# Altium schematic sheet PSU-schem.SchDoc: 13.8V 30A PSU
size Legal; Author: 4S6TMP; DrawnBy: 4S6TMP; Organization: 4S6TMP; Address1: Sri Lanka
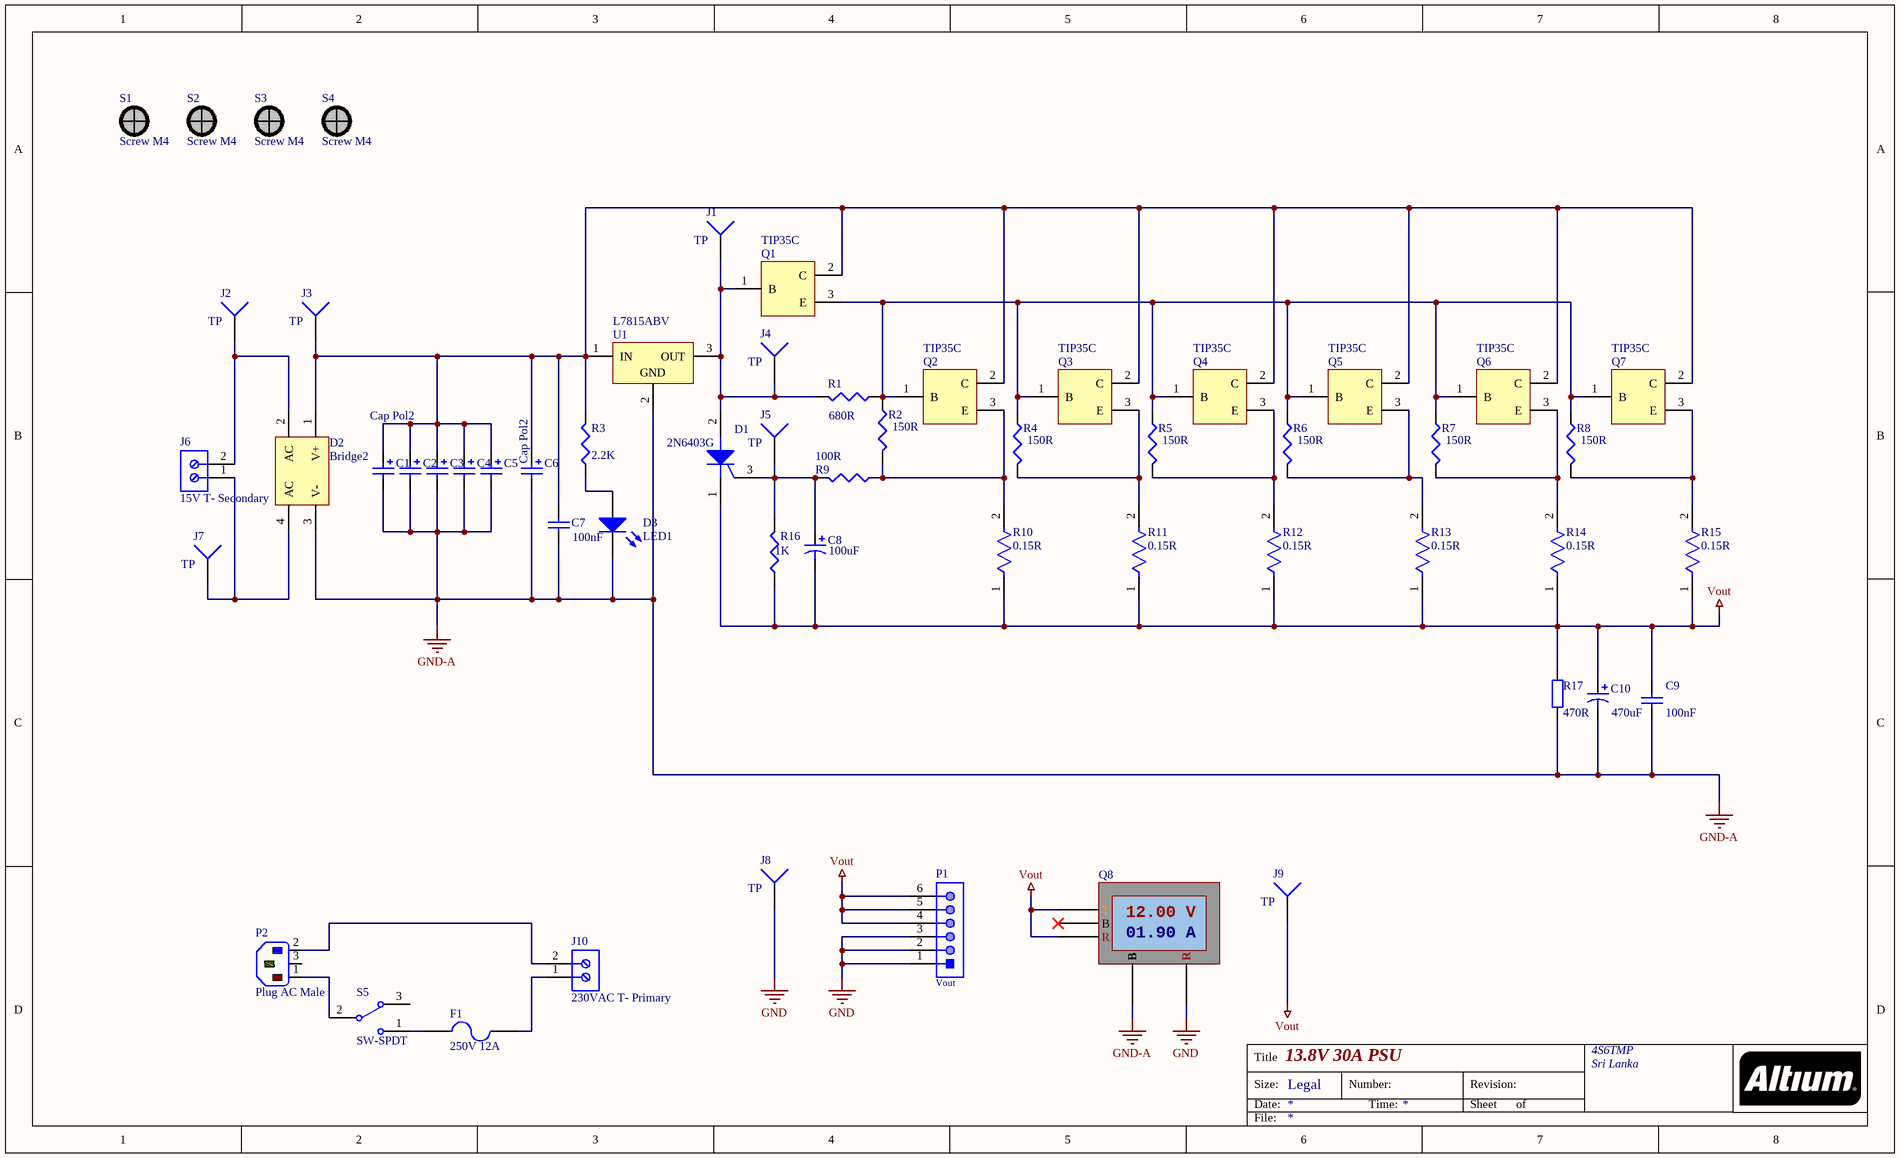
[diagram p0: PSU-schem.SchDoc]

## Parts
C1  Cap Pol2  [CAP 20mm diameter, 7.6mm pitch]
C2  Cap Pol2  [CAP 20mm diameter, 7.6mm pitch]  (value not drawn)
C3  Cap Pol2  [CAP 20mm diameter, 7.6mm pitch]  (value not drawn)
C4  Cap Pol2  [CAP 20mm diameter, 7.6mm pitch]  (value not drawn)
C5  Cap Pol2  [CAP 20mm diameter, 7.6mm pitch]  (value not drawn)
C6  Cap Pol2  [CAP 20mm diameter, 7.6mm pitch]
C7  value 100nF  [C 0603 / 1608]  (hidden comment: Cap)
C8  value 100uF  [CAPR5-4X5]  (hidden comment: Cap Pol3)
C9  value 100nF  [C 0603 / 1608]  (hidden comment: Cap)
C10  value 470uF  [RAD-0.3]  (hidden comment: Cap Pol3)
D1  2N6403G  [ONSC-TO-220-3-221A-07]
D2  Bridge2  [D-46_6A]
D3  LED1  [LED-1]
F1  250V 12A  [PIN-W2/E2.8]
J1  TP  [PIN1]
J2  TP  [PIN1]
J3  TP  [PIN1]
J4  TP  [PIN1]
J5  TP  [PIN1]
J6  15V T- Secondary  [TECO-282836-2_V]
J7  TP  [PIN1]
J8  TP  [PIN1]
J9  TP  [PIN1]
J10  230VAC T- Primary  [TECO-282836-2_V]
P1  Vout  [691312710006]
P2  Plug AC Male  [Screw terminal 3-pin 7.62mm]
Q1  TIP35C  [ONSC-SOT-93_TO-218-3-340D-02]
Q2  TIP35C  [ONSC-SOT-93_TO-218-3-340D-02]
Q3  TIP35C  [ONSC-SOT-93_TO-218-3-340D-02]
Q4  TIP35C  [ONSC-SOT-93_TO-218-3-340D-02]
Q5  TIP35C  [ONSC-SOT-93_TO-218-3-340D-02]
Q6  TIP35C  [ONSC-SOT-93_TO-218-3-340D-02]
Q7  TIP35C  [ONSC-SOT-93_TO-218-3-340D-02]
Q8  VA_Meter  [VA_Meter]  (value not drawn)
R1  value 680R  [3-0603]  (hidden comment: Res3)
R2  value 150R  [3-0603]  (hidden comment: Res3)
R3  value 2.2K  [3-0603]  (hidden comment: Res3)
R4  value 150R  [3-0603]  (hidden comment: Res3)
R5  value 150R  [3-0603]  (hidden comment: Res3)
R6  value 150R  [3-0603]  (hidden comment: Res3)
R7  value 150R  [3-0603]  (hidden comment: Res3)
R8  value 150R  [3-0603]  (hidden comment: Res3)
R9  value 100R  [3-0603]  (hidden comment: Res3)
R10  0.15R  [FP-AC05000003909JAC00-0]
R11  0.15R  [FP-AC05000003909JAC00-0]
R12  0.15R  [FP-AC05000003909JAC00-0]
R13  0.15R  [FP-AC05000003909JAC00-0]
R14  0.15R  [FP-AC05000003909JAC00-0]
R15  0.15R  [FP-AC05000003909JAC00-0]
R16  value 1K  [3-0603]  (hidden comment: Res3)
R17  value 470R  [AXIAL-0.4]  (hidden comment: Res2)
S1  Screw M4  [Screw M4]
S2  Screw M4  [Screw M4]
S3  Screw M4  [Screw M4]
S4  Screw M4  [Screw M4]
S5  SW-SPDT  [TL36WW15050]
U1  L7815ABV  [TO220]

## Nets
GND: J8.1 P1.1 P1.2 P1.3 Q8.5(R)
GND-A: C1.2 C2.2 C3.2 C4.2 C5.2 C6.2 C7.1 C9.1 C10.2 D2.3(V-) D3.2(K) Q8.4(B) R17.1 U1.2(GND)
Vout: C8.2 C9.2 C10.1 D1.1(K) J9.1 P1.4 P1.5 P1.6 Q8.1(Y) Q8.3(R) R10.1 R11.1 R12.1 R13.1 R14.1 R15.1 R16.1 R17.2
NetC1_1: C1.1 C2.1 C3.1 C4.1 C5.1 C6.1 C7.2 D2.1(V+) J3.1 Q1.2(C) Q2.2(C) Q3.2(C) Q4.2(C) Q5.2(C) Q6.2(C) Q7.2(C) R3.2 U1.1(IN)
NetC8_1: C8.1 D1.3(G) J5.1 R9.2 R16.2
NetD1_2: D1.2(A) J1.1 J4.1 Q1.1(B) R1.2 U1.3(OUT)
NetD2_2: D2.2(AC) J2.1 J6.2
NetD2_4: D2.4(AC) J6.1 J7.1
NetD3_1: D3.1(A) R3.1
NetF1_1: F1.1 S5.1
NetF1_2: F1.2 J10.1
NetJ10_2: J10.2 P2.2(N)
NetP2_1: P2.1(L) S5.2
NetQ1_3: Q1.3(E) Q2.1(B) Q3.1(B) Q4.1(B) Q5.1(B) Q6.1(B) Q7.1(B) R1.1 R2.1 R4.1 R5.1 R6.1 R7.1 R8.1
NetQ2_3: Q2.3(E) R2.2 R9.1 R10.2
NetQ3_3: Q3.3(E) R4.2 R11.2
NetQ4_3: Q4.3(E) R5.2 R12.2
NetQ5_3: Q5.3(E) R6.2 R13.2
NetQ6_3: Q6.3(E) R7.2 R14.2
NetQ7_3: Q7.3(E) R8.2 R15.2

Not connected (* = marked no-connect by the designer): P2 3(E); Q8 2(B)*; S5 3

## Notes on the sheet
- Title
- Size:
- Date:
- Legal
- Number:
- Time:
- Revision:
- Sheet
- of
- File:
- (in symbol VA_Meter) 12.00 V; 01.90 A

## Library data of the parts
C1-C6 = Cap Pol2: Polarized Capacitor (Axial); Value: 100pF; Published: 8-Jun-2000; LatestRevisionDate: 17-Jul-2002; LatestRevisionNote: Re-released for DXP Platform.; PackageReference: POLAR0.8; Publisher: Altium Limited; PackageDescription: Polarized Capacitor; 2 Leads
C7 C9 = Cap: Capacitor; Published: 8-Jun-2000; LatestRevisionDate: 17-Jul-2002; LatestRevisionNote: Re-released for DXP Platform.; PackageReference: RAD-0.3; Publisher: Altium Limited; PackageDescription: Radial Cap, Thru-Hole; 2 Leads; 0.3 in Pin Spacing
C8 C10 = Cap Pol3: Polarized Capacitor (Surface Mount); Published: 8-Jun-2000; LatestRevisionDate: 29-May-2009; LatestRevisionNote: IPC-7351 Footprint Added.; PackageReference: C0805; Publisher: Altium Limited; PackageDescription: Chip Capacitor
D1 = CMP-1068-00092-1: Silicon Controlled Rectifier, Reverse Blocking Thyristor, 3-Pin TO-220, Pb-Free, Bulk Box; Manufacturer: On Semiconductor; IT(RMS) Max (A): 16; ITSM Max (A): 160; RoHS: Pb-Free; PartNumber: 2N6403G; ComponentLink1URL: http://www.onsemi.com/; PackageDescription: 3-Pin Flange Mount, Vertical Straight Lead, Body 9.97 x 4.445 mm, Pitch 2.54 mm; ComponentLink3Description: Package Specification; ComponentLink3URL: http://www.onsemi.com/pub_link/Collateral/221A-07.PDF; PackageReference: TO-220-3-221A-07; Packing: Bulk Box; DatasheetVersion: Rev. 6; ComponentLink1Description: Manufacturer URL; Mounting Technology: Through Hole; ComponentLink2URL: http://www.onsemi.cn/pub_link/Collateral/2N6400-D.PDF; ComponentLink2Description: Datasheet; PackageVersion: Rev. O, 07/2008
D2 = Bridge2: Diode Bridge; Published: 24-Mar-1999; LatestRevisionDate: 17-Jul-2002; LatestRevisionNote: Re-released for DXP Platform.; PackageReference: D-46_6A; Publisher: Altium Limited; PackageDescription: Bridge Rectifier; 4 Terminals; Body 16.8 x 16.8 mm (typ); Pitch 10.67 mm
D3 = LED1: Typical RED GaAs LED; Published: 8-Jun-2000; LatestRevisionDate: 08-Jul-2005; LatestRevisionNote: Mech Layer 1 removed.; PackageReference: LED-1; Publisher: Altium Limited; PackageDescription: LED; 2 Leads
F1 = Fuse 2: Fuse; Published: 8-Jun-2000; LatestRevisionDate: 17-Jul-2002; LatestRevisionNote: Re-released for DXP Platform.; PackageReference: PIN-W2/E2.8; Publisher: Altium Limited; PackageDescription: Thru-Hole; 2 Leads
J1-J5 J7-J9 = Socket: LatestRevisionDate: 17-Jul-2002; LatestRevisionNote: Re-released for DXP Platform.; Publisher: Altium Limited
J6 J10 = CMP-1684-00017-1: Female Header, Pitch 5 mm, 1 x 2 Position, Height 10 mm, Tail Length 3.5 mm, Rohs, Bulk; Manufacturer: TE Connectivity; Wire Gauge: 16-30AWG; Product Training Modules: Wire-to-BoardEurostyleTerminalBlocks; Clamp Material - Plating: Brass-NickelPlated; Voltage: 300V; Mating Orientation: HorizontalwithBoard; Current: 13.5A; Pitch: 0.197"(5.00mm); Screw Thread: M3; 3D Model: 282836-2.pdf; Other Names: 5ULV-02B / A98076; Dynamic Catalog: BuchananSeries; Number of Levels: 1; Torque - Screw: 0.68Nm(6Lb-In); Featured Product: EurostyleTerminalBlockConnectors; Positions Per Level: 2; Wire Termination: Screw-RisingCageClamp; Datasheet URL: http://www.te.com.cn/commerce/DocumentDelivery/DDEController?Action=showdoc&DocId=Catalog+Section%7F1308389_EUROSTYLE_TERMINAL_BLOCKS%7F0607%7Fpdf%7FEnglish%7FENG_CS_1308389_EUROSTYLE_TERMINAL_BLOCKS_0607.pdf%7F282836-2; Color: Green; Family: TerminalBlocks-WiretoBoard; RoHS Information: 282836-2StatementofCompliance; Standard Package: 300; Contact Material - Plating: Brass-TinPlated; Manufacturer URL: http://www.te.com; Housing Material: Polyamide(PA66),Nylon6/6; Features: Interlocking(Side); Package Description: Female Header, Pitch 5 mm, 1 x 2 Position, Height 10 mm, Tail Length 3.5 mm; Mounting Type: ThroughHole; Package Reference: THD; Packaging: Bulk; Series: Buchanan; Category: Connectors,Interconnects; Screw Material - Plating: Brass-NickelPlated
P1 = CMP-1502-02044-1: Serie 3127 - 5.00mm Open Horizontal PCB Header WR-TBL, 6 pin; Manufacturer: Wurth Elektronik; Pin Number: 6; Gender: Male; Part Number: 691312710006; Datasheet URL: http://katalog.we-online.de/em/datasheet/6913127100xx.pdf; Manufacturer URL: http://www.we-online.de; Operating Temperature: -40to105degC; Publisher: WurthElektronik; Package Reference: 691312710006; Mounting Technology: THT; Packaging: Box; Pitch: 5.00mm
P2 = Plug AC Male: IEC Mains Power Inlet, EN60 320-1 C14 Class I Cold Condition, PC Flange Rear Mount, Chassis Plug; PackageDocument: ver.80, 15-Sep-2003; MaximumRating: 10A, 250V a.c. (UL & CSA 15A, 250V a.c.); MountingFixtures: Not drawn on schematic symbol.; PCB_Layout: Complies with manufacturer's recommendation.; DrillSize: Corresponds to nominal value.; Note: IEC Color Scheme employed for L, N and E.; Published: 15-Jul-2004; LatestRevisionDate: 15-Jul-2004; LatestRevisionNote: Component Replaced.; DatasheetDocument: ver.80, 15-Sep-2003; PackageReference: PX0580/PC; Publisher: Altium Limited; Terminations: P.C. Spills; ComponentLink1Description: Manufacturer Link; ComponentLink1URL: http://www.bulgin.co.uk/
Q1-Q7 = CMP-1048-00995-1: Complementary Silicon High-Power Transistor, 3-Pin SOT-93, Tube; Manufacturer: On Semiconductor; IC Continuous (A): 25; Polarity: NPN; fT Min (MHz): 3; PackageDescription: 3-Pin Flange Mount, Vertical Straight Lead, Body 14.95 x 4.8 mm, Pitch 5.475 mm; ComponentLink2URL: http://www.onsemi.com/pub_link/Collateral/TIP35A-D.PDF; ComponentLink2Description: Datasheet; ComponentLink1Description: Manufacturer URL; ComponentLink1URL: http://www.onsemi.com/; PartNumber: TIP35C; Mounting Technology: Through Hole; RoHS: FALSE; Packing: Tube; PackageVersion: Rev. E; PackageReference: SOT-93_TO-218-3-340D-02; DatasheetVersion: Rev. 6; ComponentLink3Description: Package Specification; ComponentLink3URL: http://www.onsemi.com/pub_link/Collateral/TIP33C-D.PDF
Q8 = VA_Meter: Digital V/A Meter
R1 = Res3: Resistor; Manufacturer: Uniroyal; Manufacturer Part Number: 0603WAJ0681T5E; Published: 8-Jun-2000; LatestRevisionDate: 29-May-2009; LatestRevisionNote: IPC-7351 Footprint Added.; PackageReference: J1-0603; Publisher: Altium Limited; PackageDescription: Chip Resistor; Supplier 1: LCSC; Supplier Part Number 1: C25253; Stock 1: 367400; Pricing 1: 100=0.00170, 1000=0.00130, 3000=0.00120, 10000=0.00120, 50000=0.00120, 100000=0.00100, 100=0.00160, 1000=0.00120, 3000=0.00110, 10000=0.00110, 50000=0.00110, 100000=0.00100, 100=0.00840, 1000=0.00650, 3000=0.00580, 10000=0.00580, 50000=0.00580, 100000=0.00520, 100=0.00800, 1000=0.00620, 3000=0.00550, 10000=0.00550, 50000=0.00550, 100000=0.00490, 100=0.00110, 1000=0.00080, 3000=0.00070, 10000=0.00070, 50000=0.00070, 100000=0.00070, 100=0.00090, 1000=0.00070, 3000=0.00060, 10000=0.00060, 50000=0.00060, 100000=0.00060, 100=0.01010, 1000=0.00780, 3000=0.00700, 10000=0.00700, 50000=0.00700, 100000=0.00620, 100=0.14080, 1000=0.10830, 3000=0.09750, 10000=0.09750, 50000=0.09750, 100000=0.08660, 100=0.00530, 1000=0.00410, 3000=0.00370, 10000=0.00370, 50000=0.00370, 100000=0.00330, 100=0.09750, 1000=0.07500, 3000=0.06750, 10000=0.06750, 50000=0.06750, 100000=0.06000, 100=0.01090, 1000=0.00840, 3000=0.00750, 10000=0.00750, 50000=0.00750, 100000=0.00670, 100=0.00170, 1000=0.00130, 3000=0.00120, 10000=0.00120, 50000=0.00120, 100000=0.00110, 100=0.00130, 1000=0.00100, 3000=0.00090, 10000=0.00090, 50000=0.00090, 100000=0.00080 (AUD)
R2-R9 R16 = Res3: Resistor; Published: 8-Jun-2000; LatestRevisionDate: 29-May-2009; LatestRevisionNote: IPC-7351 Footprint Added.; PackageReference: J1-0603; Publisher: Altium Limited; PackageDescription: Chip Resistor
R10-R15 = CMP-02408-000001-1: RES 0.15 OHM 5W 5%; Resistance: 0.15Ω; Device Class L2: Resistors; Device Class L3: Through-Hole Resistors; Power Rating: 5W; Category: Res; Value: 0.15R; Device Class L1: Passive Components; ComponentLink2URL: http://www.vishay.com/docs/28730/acac-at.pdf; ComponentLink2Description: Datasheet
R17 = Res2: Resistor; Published: 8-Jun-2000; LatestRevisionDate: 17-Jul-2002; LatestRevisionNote: Re-released for DXP Platform.; PackageReference: AXIAL-0.4; Publisher: Altium Limited; PackageDescription: Axial Device, Thru-Hole; 2 Leads; 0.4 in Pin Spacing
S5 = SW-SPDT: SPDT Subminiature Toggle Switch, Right Angle Mounting, Vertical Actuation; Published: 24-Mar-1999; LatestRevisionDate: 17-Dec-2003; LatestRevisionNote: Schematic revised, PCB Footprint replaced.; DatasheetVersion: 05-Dec-2000; PackageReference: TL36WW15050; Publisher: Altium Limited; PackageDescription: Switch; 4 Leads; ComponentLink1Description: Manufacturer Link; ComponentLink1URL: http://www.apem.com
U1 = CMP-0244-00468-1: Positive Voltage Regulator, 15V, 3-Pin TO-220; ComponentLink1URL: http://www.st.com; ComponentLink3Description: Package Specification; ComponentLink3URL: http://www.st.com/internet/com/TECHNICAL_RESOURCES/TECHNICAL_LITERATURE/PACKAGE_INFORMATION/CD00004649.pdf; DatasheetVersion: 16/11/2011; ComponentLink2URL: http://www.st.com/internet/com/TECHNICAL_RESOURCES/TECHNICAL_LITERATURE/DATASHEET/CD00000444.pdf; PackageDescription: TO, Thru-Hole, Vertical, Heatsink Mounted; 3 In-Line Leads; Pitch 2.54 mm; ComponentLink1Description: Manufacturer URL; PackageVersion: ver3.0; ComponentLink2Description: Datasheet; PackageReference: TO220